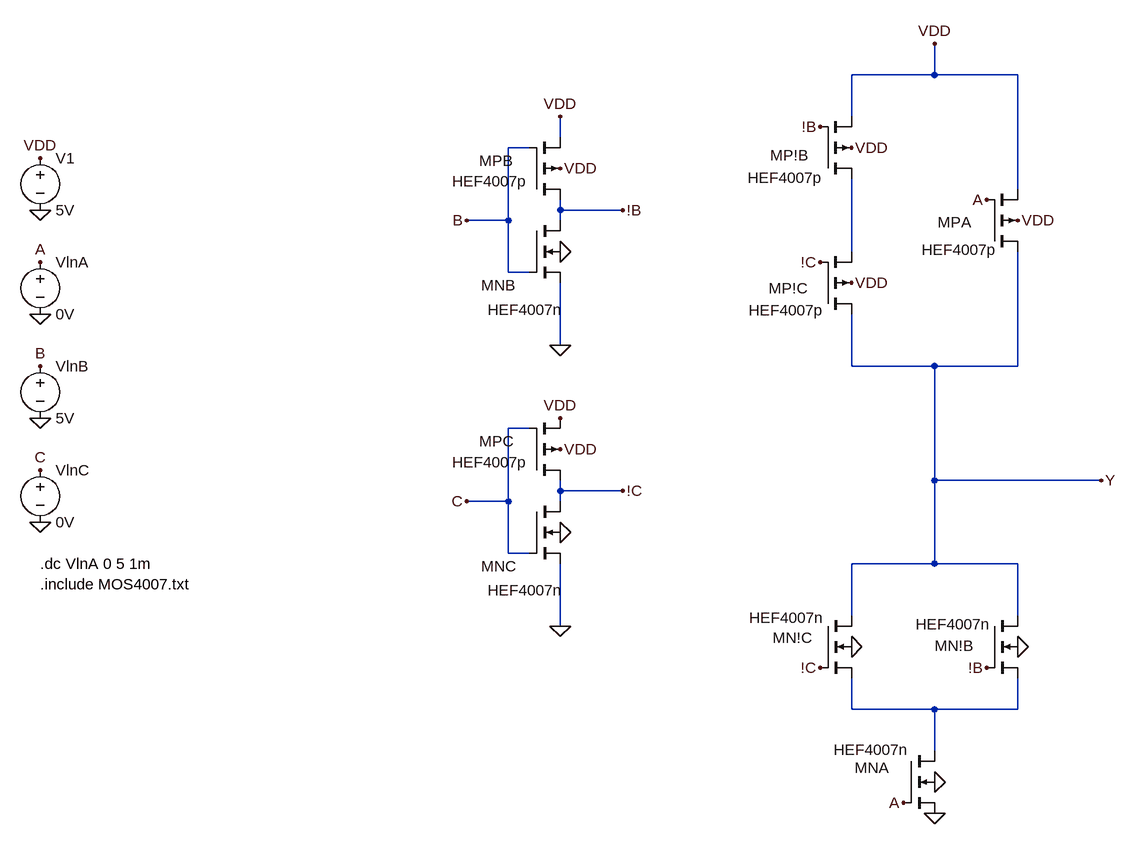
[diagram p0: schematic gate-CMOS-VTC.asc]
gate-CMOS-VTC.asc, the LTspice schematic file:
Version 4
SHEET 1 1764 1236
WIRE 800 32 800 -16
WIRE 800 32 672 32
WIRE 928 32 800 32
WIRE 672 96 672 32
WIRE 224 128 224 96
WIRE 176 144 144 144
WIRE 928 208 928 32
WIRE 224 240 224 224
WIRE 320 240 224 240
WIRE 144 256 144 144
WIRE 144 256 80 256
WIRE 224 256 224 240
WIRE 672 304 672 192
WIRE 144 336 144 256
WIRE 176 336 144 336
WIRE 224 448 224 352
WIRE 672 480 672 400
WIRE 800 480 672 480
WIRE 928 480 928 304
WIRE 928 480 800 480
WIRE 176 576 144 576
WIRE 800 656 800 480
WIRE 1056 656 800 656
WIRE 224 672 224 656
WIRE 320 672 224 672
WIRE 144 688 144 576
WIRE 144 688 80 688
WIRE 224 688 224 672
WIRE 144 768 144 688
WIRE 176 768 144 768
WIRE 800 784 800 656
WIRE 800 784 672 784
WIRE 928 784 800 784
WIRE 672 864 672 784
WIRE 928 864 928 784
WIRE 224 880 224 784
WIRE 672 1008 672 960
WIRE 800 1008 672 1008
WIRE 928 1008 928 960
WIRE 928 1008 800 1008
WIRE 800 1072 800 1008
FLAG 80 256 B
FLAG 224 304 0
FLAG -576 160 VDD
FLAG -576 240 0
FLAG 224 176 VDD
FLAG 224 448 0
FLAG -576 320 A
FLAG -576 400 0
FLAG 224 96 VDD
FLAG 80 688 C
FLAG 224 736 0
FLAG 224 608 VDD
FLAG 224 880 0
FLAG 224 560 VDD
FLAG -576 480 B
FLAG -576 640 C
FLAG -576 560 0
FLAG -576 720 0
FLAG 320 240 !B
FLAG 320 672 !C
FLAG 800 -16 VDD
FLAG 672 144 VDD
FLAG 928 256 VDD
FLAG 672 352 VDD
FLAG 624 112 !B
FLAG 624 320 !C
FLAG 880 224 A
FLAG 1056 656 Y
FLAG 800 1168 0
FLAG 672 912 0
FLAG 928 912 0
FLAG 624 944 !C
FLAG 880 944 !B
FLAG 752 1152 A
FLAG 800 1120 0
SYMBOL nmos4 176 256 R0
WINDOW 0 -74 100 Left 2
WINDOW 3 -64 137 Left 2
SYMATTR InstName MNB
SYMATTR Value HEF4007n
SYMBOL pmos4 176 224 M180
WINDOW 0 -77 60 Left 2
WINDOW 3 -118 28 Left 2
SYMATTR InstName MPB
SYMATTR Value HEF4007p
SYMBOL voltage -576 144 R0
SYMATTR InstName V1
SYMATTR Value 5V
SYMBOL voltage -576 304 R0
SYMATTR InstName VlnA
SYMATTR Value 0V
SYMBOL nmos4 176 688 R0
WINDOW 0 -74 100 Left 2
WINDOW 3 -64 137 Left 2
SYMATTR InstName MNC
SYMATTR Value HEF4007n
SYMBOL pmos4 176 656 M180
WINDOW 0 -77 60 Left 2
WINDOW 3 -118 28 Left 2
SYMATTR InstName MPC
SYMATTR Value HEF4007p
SYMBOL voltage -576 464 R0
SYMATTR InstName VlnB
SYMATTR Value 5V
SYMBOL voltage -576 624 R0
SYMATTR InstName VlnC
SYMATTR Value 0V
SYMBOL pmos4 624 192 M180
WINDOW 0 -77 36 Left 2
WINDOW 3 -112 2 Left 2
SYMATTR InstName MP!B
SYMATTR Value HEF4007p
SYMBOL pmos4 880 304 M180
WINDOW 0 -75 45 Left 2
WINDOW 3 -100 3 Left 2
SYMATTR InstName MPA
SYMATTR Value HEF4007p
SYMBOL pmos4 624 400 M180
WINDOW 0 -79 40 Left 2
WINDOW 3 -110 6 Left 2
SYMATTR InstName MP!C
SYMATTR Value HEF4007p
SYMBOL nmos4 624 864 R0
WINDOW 0 -73 34 Left 2
WINDOW 3 -109 3 Left 2
SYMATTR InstName MN!C
SYMATTR Value HEF4007n
SYMBOL nmos4 880 864 R0
WINDOW 0 -80 46 Left 2
WINDOW 3 -109 13 Left 2
SYMATTR InstName MN!B
SYMATTR Value HEF4007n
SYMBOL nmos4 752 1072 R0
WINDOW 0 -75 26 Left 2
WINDOW 3 -107 -2 Left 2
SYMATTR InstName MNA
SYMATTR Value HEF4007n
TEXT -576 784 Left 2 !.dc VlnA 0 5 1m
TEXT -576 816 Left 2 !.include MOS4007.txt

The netlist it stands for:
* gate-CMOS-VTC.asc
MNB !B B 0 0 HEF4007n
MPB !B B VDD VDD HEF4007p
V1 VDD 0 5V
VlnA A 0 0V
MNC !C C 0 0 HEF4007n
MPC !C C VDD VDD HEF4007p
VlnB B 0 5V
VlnC C 0 0V
MP!B N001 !B VDD VDD HEF4007p
MPA Y A VDD VDD HEF4007p
MP!C Y !C N001 VDD HEF4007p
MN!C Y !C N002 0 HEF4007n
MN!B Y !B N002 0 HEF4007n
MNA N002 A 0 0 HEF4007n
.model NMOS NMOS
.model PMOS PMOS
.lib standard.mos
.dc VlnA 0 5 1m
.include MOS4007.txt
.backanno
.end